# Altium schematic sheet 串口通信电路.SchDoc
size A4; SheetNumber: 4; SheetTotal: 6
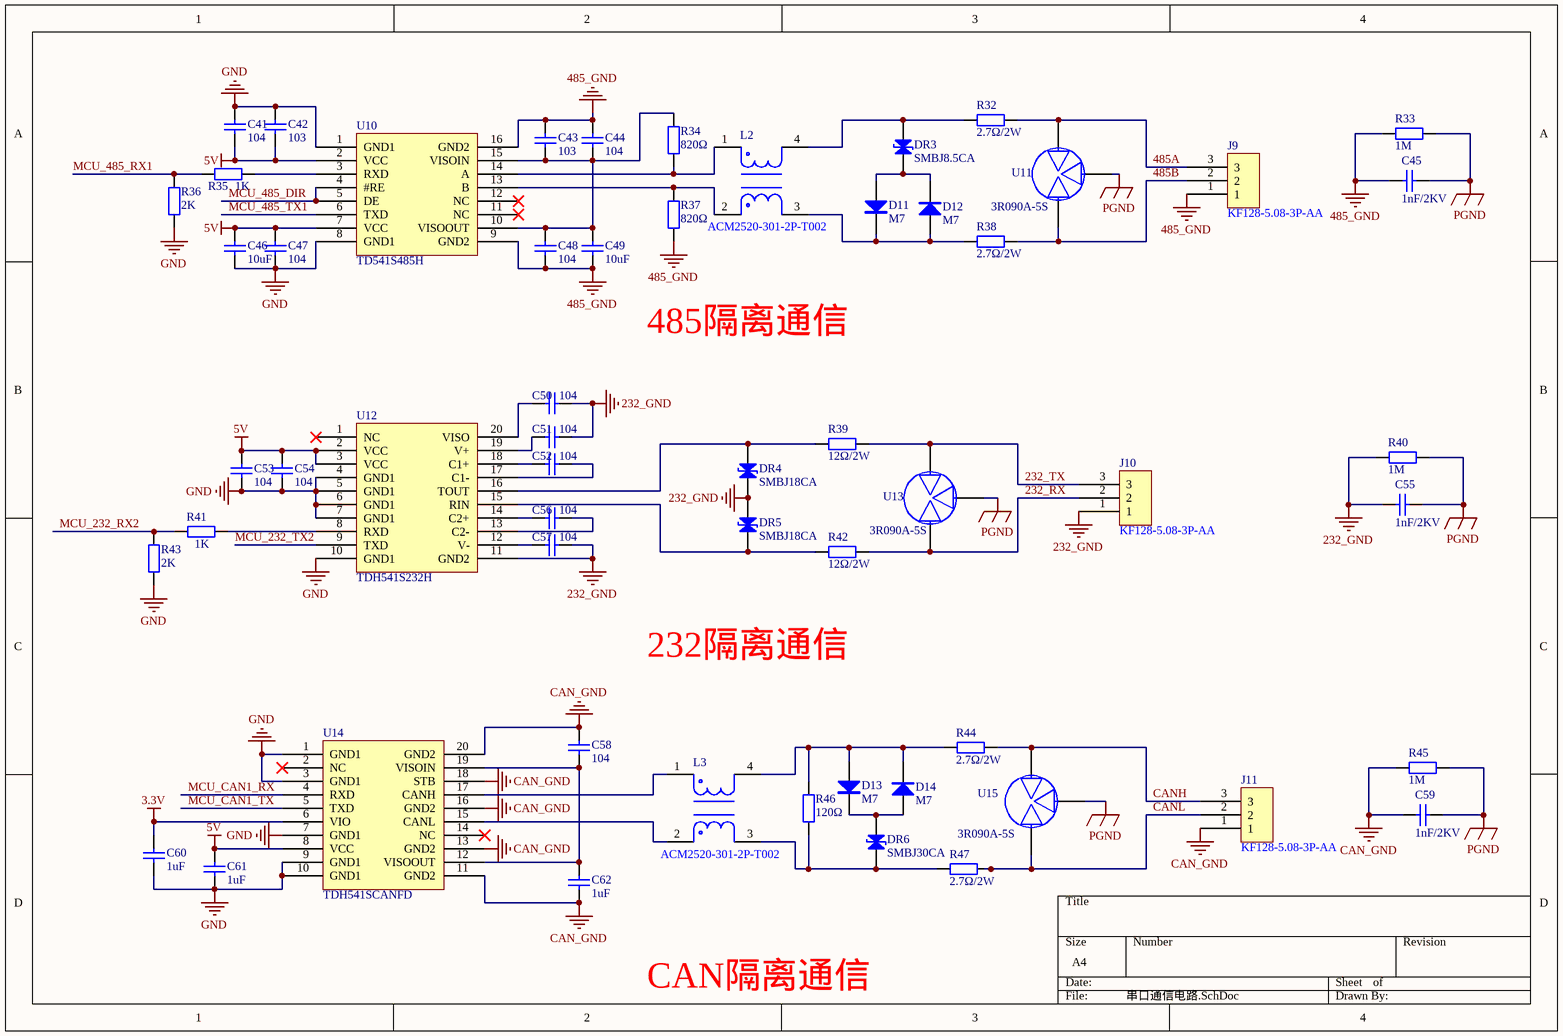
[diagram p0: 串口通信电路.SchDoc]

## Parts
C41  104  [C 0603_L]
C42  103  [C 0603_L]
C43  103  [C 0603_L]
C44  104  [C 0603_L]
C45  1nF/2KV  [C1206_L]
C46  10uF  [C 0603_L]
C47  104  [C 0603_L]
C48  104  [C 0603_L]
C49  10uF  [C 0603_L]
C50  104  [C 0603_L]
C51  104  [C 0603_L]
C52  104  [C 0603_L]
C53  104  [C 0603_L]
C54  104  [C 0603_L]
C55  1nF/2KV  [C1206_L]
C56  104  [C 0603_L]
C57  104  [C 0603_L]
C58  104  [C 0603_L]
C59  1nF/2KV  [C1206_L]
C60  1uF  [C 0603_L]
C61  1uF  [C 0603_L]
C62  1uF  [C 0603_L]
D11  M7  [SMA]
D12  M7  [SMA]
D13  M7  [SMA]
D14  M7  [SMA]
DR3  SMBJ8.5CA  [SMB]
DR4  SMBJ18CA  [SMB]
DR5  SMBJ18CA  [SMB]
DR6  SMBJ30CA  [SMB]
J9  KF128-5.08-3P-AA  [KF128-5.08-3P]
J10  KF128-5.08-3P-AA  [KF128-5.08-3P]
J11  KF128-5.08-3P-AA  [KF128-5.08-3P]
L2  ACM2520-301-2P-T002  [FILTER-SMD_4P-L2.5-W2.0-BL]
L3  ACM2520-301-2P-T002  [FILTER-SMD_4P-L2.5-W2.0-BL]
R32  2.7Ω/2W  [R2512_L]
R33  1M  [R1206_L]
R34  820Ω  [R 0603_L]
R35  1K  [R 0603_L]
R36  2K  [R 0603_L]
R37  820Ω  [R 0603_L]
R38  2.7Ω/2W  [R2512_L]
R39  12Ω/2W  [R2512_L]
R40  1M  [R1206_L]
R41  1K  [R 0603_L]
R42  12Ω/2W  [R2512_L]
R43  2K  [R 0603_L]
R44  2.7Ω/2W  [R2512_L]
R45  1M  [R1206_L]
R46  120Ω  [R 0603_L]
R47  2.7Ω/2W  [R2512_L]
U10  TD541S485H  [DFN-16_L13.0-W10.0-P1.27-BL]
U11  3R090A-5S  [DIO-DT-SMD_L7.5-W5.0]
U12  TDH541S232H  [DFN-20_L13.0-W10.0-P1.27-BL]
U13  3R090A-5S  [DIO-DT-SMD_L7.5-W5.0]
U14  TDH541SCANFD  [DFN-20_L13.0-W10.0-P1.27-BL]
U15  3R090A-5S  [DIO-DT-SMD_L7.5-W5.0]

## Nets
3.3V: C60.2 U14.6(VIO)
5V: C41.1 C42.1 C46.2 C47.2 C53.2 C54.2 C61.2 U10.2(VCC) U10.7(VCC) U12.2(VCC) U12.3(VCC) U14.8(VCC)
232_GND: C50.1 C51.1 C55.1 C57.1 DR4.2(K) DR5.1(A) J10.1 R40.1 U12.11(GND2)
485_GND: C43.2 C44.2 C45.1 C48.1 C49.1 J9.1 R33.1 R37.1 U10.9(GND2) U10.16(GND2)
CAN_GND: C58.2 C59.1 C62.1 J11.1 R45.1 U14.11(GND2) U14.13(GND2) U14.16(GND2) U14.18(STB) U14.20(GND2)
GND: C41.2 C42.2 C46.1 C47.1 C53.1 C54.1 C60.1 C61.1 R36.1 R43.1 U10.1(GND1) U10.8(GND1) U12.4(GND1) U12.5(GND1) U12.6(GND1) U12.7(GND1) U12.10(GND1) U14.1(GND1) U14.3(GND1) U14.7(GND1) U14.9(GND1) U14.10(GND1)
PGND: C45.2 C55.2 C59.2 R33.2 R40.2 R45.2 U11.2 U13.2 U15.2
232_RX: J10.2 R42.2 U13.3
232_TX: J10.3 R39.2 U13.1
485A: J9.3 R32.2 U11.1
485B: J9.2 R38.2 U11.3
CANH: J11.3 R44.2 U15.1
CANL: J11.2 R47.2 U15.3
MCU_232_RX2: R41.2 R43.2
MCU_232_TX2: U12.9(TXD)
MCU_485_DIR: U10.4(#RE) U10.5(DE)
MCU_485_RX1: R35.1 R36.2
MCU_485_TX1: U10.6(TXD)
MCU_CAN1_RX: U14.4(RXD)
MCU_CAN1_TX: U14.5(TXD)
NetC43_1: C43.1 C44.1 C48.2 C49.2 R34.2 U10.10(VISOOUT) U10.15(VISOIN)
NetC50_2: C50.2 U12.20(VISO)
NetC51_2: C51.2 U12.19(V+)
NetC52_1: C52.1 U12.17(C1-)
NetC52_2: C52.2 U12.18(C1+)
NetC56_1: C56.1 U12.13(C2-)
NetC56_2: C56.2 U12.14(C2+)
NetC57_2: C57.2 U12.12(V-)
NetC58_1: C58.1 C62.2 U14.12(VISOOUT) U14.19(VISOIN)
NetD11_1: D11.1(A) D12.2(K) DR3.2(K)
NetD11_2: D11.2(K) D12.1(A) L2.3 R38.1
NetD13_1: D13.1(A) D14.2(K) L3.4 R44.1 R46.1
NetD13_2: D13.2(K) D14.1(A) DR6.2(K)
NetDR3_1: DR3.1(A) L2.4 R32.1
NetDR4_1: DR4.1(A) R39.1 U12.16(TOUT)
NetDR5_2: DR5.2(K) R42.1 U12.15(RIN)
NetDR6_1: DR6.1(A) L3.3 R46.2 R47.1
NetL2_1: L2.1 R34.1 U10.14(A)
NetL2_2: L2.2 R37.2 U10.13(B)
NetL3_1: L3.1 U14.17(CANH)
NetL3_2: L3.2 U14.15(CANL)
NetR35_2: R35.2 U10.3(RXD)
NetR41_1: R41.1 U12.8(RXD)

Not connected (* = marked no-connect by the designer): U10 11(NC)* 12(NC)*; U12 1(NC)*; U14 2(NC)* 14(NC)*

## Notes on the sheet
- 485隔离通信
- 232隔离通信
- CAN隔离通信

## Library data of the parts
C41-C62 = Cap: 0603贴片电容; Published: 8-Jun-2000; LatestRevisionDate: 17-Jul-2002; LatestRevisionNote: Re-released for DXP Platform.; PackageReference: RAD-0.3; Publisher: Altium Limited; PackageDescription: Radial Cap, Thru-Hole; 2 Leads; 0.3 in Pin Spacing
D11-D14 = M7: 整流二极管; 淘宝ID: 封装库来自淘宝 ID：黄晶宝石; 封装库来自淘宝卖家 ID：黄晶宝石: 其他店铺购入均为盗版，不享受售后技术支持服务，请立即申请退款; BOM名称: 整流二极管; 联系售后，技术支持: https://shop463601444.taobao.com
DR3-DR6 = TVS: SMB,瞬态抑制二极管; BOM名称: 瞬态电压抑制二极管; 版权归属: 源创客; 学习资源: www.ooocke.com
J9-J11 = KF128-5.08-3P-AA: KF128-5.08-3P-AA端座; Manufacturer: KEFA(科发); Add into BOM: yes; Structure: 1x3P; Pitch: 5.08mm; Current Rating (Max): 24A; Voltage Rating (Max): 250V; Wire Gauge - AWG: 12~22; Wire Gauge - mm2: 2.5; Number of PINs Per Row: 3; Symbol: KF128-5.08-3P; Device: KF128-5.08-3P-AA; LCSC Part Name: 5.08mm 1x3P 排数:1 每排P数:3 直插; Supplier Part: C474953; Manufacturer Part: KF128-5.08-3P-AA; Supplier Footprint: 插件,P=5.08mm; JLCPCB Part Class: 扩展库; Datasheet: https://atta.szlcsc.com/upload/public/pdf/source/20230317/DADFED05827EAD48C1D5B8C3D4CF88F4.pdf; Supplier: LCSC; Convert to PCB: yes; Color: 绿色; Mounting Style: 直插; Number of Pins: 3P; Number of Rows: 1; Operating Temperature Range: -40℃~+105℃
L2 L3 = ACM2520-301-2P-T002: 共模电感; Manufacturer: TDK; Add into BOM: yes; Number of Lines: 2; Current Rating: 400mA; Impedance @ Frequency: 300Ω@100MHz; Voltage Rating - DC: 20V; DC Resistance(DCR): 350mΩ; Insulation Resistance(IR): 10MΩ; Symbol: ACM2520-301-2P-T002; Device: ACM2520-301-2P-T002; LCSC Part Name: 两路 2520共模滤波器 阻抗300Ω@100MHz; Supplier Part: C76577; Manufacturer Part: ACM2520-301-2P-T002; Supplier Footprint: SMD-4P,2.5x2mm; JLCPCB Part Class: 扩展库; Datasheet: https://item.szlcsc.com/datasheet/ACM2520-301-2P-T002/77704.html; Supplier: LCSC; Convert to PCB: yes; Operating Temperature: -40℃~+85℃
R32-R47 = Res: 0603贴片电阻; BOM名称: 贴片电阻; 版权归属: 源创客; 学习资源: www.ooocke.com
U10 = TD541S485H: 金升阳485隔离芯片（带隔离电源）; Manufacturer: MORNSUN(金升阳); Add into BOM: yes; Symbol: TD541S485H; Device: TD541S485H; LCSC Part Name: 3.3V或5.5V供电 1Mbps 带静电保护收发器; Supplier Part: C707458; Manufacturer Part: TD541S485H; Supplier Footprint: DFN-16(10x13); JLCPCB Part Class: 扩展库; Datasheet: https://item.szlcsc.com/datasheet/TD541S485H/745222.html; Supplier: LCSC; Convert to PCB: yes
U11 U13 U15 = 3R090A-5S_C48642393: 气体放电管; Manufacturer: R+O(宏嘉诚); Add into BOM: yes; Number of Poles: 3; Voltage - DC Spark Over (Nom): 90V; Tolerance: ±20%; Impulse Discharge Current: 5kA; inter-electrode capacitance: 1.5pF; Impulse Breakdown Voltage(Vimp): 600V; Symbol: 3R090A-5S; Device: 3R090A-5S_C48642393; LCSC Part Name: 90V 5kA 3; Supplier Part: C48642393; Manufacturer Part: 3R090A-5S; Supplier Footprint: SMD-3P,7.5x5mm; JLCPCB Part Class: 扩展库; Datasheet: https://item.szlcsc.com/datasheet/3R090A-5S/50921357.html; Supplier: LCSC; Convert to PCB: yes; Operating Temperature Range: -40℃~+85℃; Diameter (φD): 7.5mm
U12 = TDH541S232H: 金升阳232隔离芯片（带隔离电源）; Manufacturer: MORNSUN(金升阳); Add into BOM: yes; Isolation Voltage(Vrms): 5000; CMTI(kV/us): 25kV/us; Voltage - Supply: 4.5V~5.5V; Symbol: TDH541S232H; Device: TDH541S232H; LCSC Part Name: TDH541S232H; Supplier Part: C5116474; Manufacturer Part: TDH541S232H; Supplier Footprint: DFN-20(10x13); JLCPCB Part Class: 扩展库; Datasheet: https://item.szlcsc.com/datasheet/TDH541S232H/5692546.html; Supplier: LCSC; Convert to PCB: yes; Operating Temperature: -40℃~+85℃
U14 = TDH541SCANFD: 金升阳CAN芯片（带隔离电源）; Manufacturer: MORNSUN(金升阳); Add into BOM: yes; Symbol: TDH541SCANFD; Device: TDH541SCANFD; LCSC Part Name: TDH541SCANFD 停产; Supplier Part: C4355532; Manufacturer Part: TDH541SCANFD; Supplier Footprint: DFN-20(10x13); JLCPCB Part Class: 扩展库; Datasheet: https://item.szlcsc.com/datasheet/TDH541SCANFD/4926205.html; Supplier: LCSC; Convert to PCB: yes